# Altium project 总板.PrjPCB
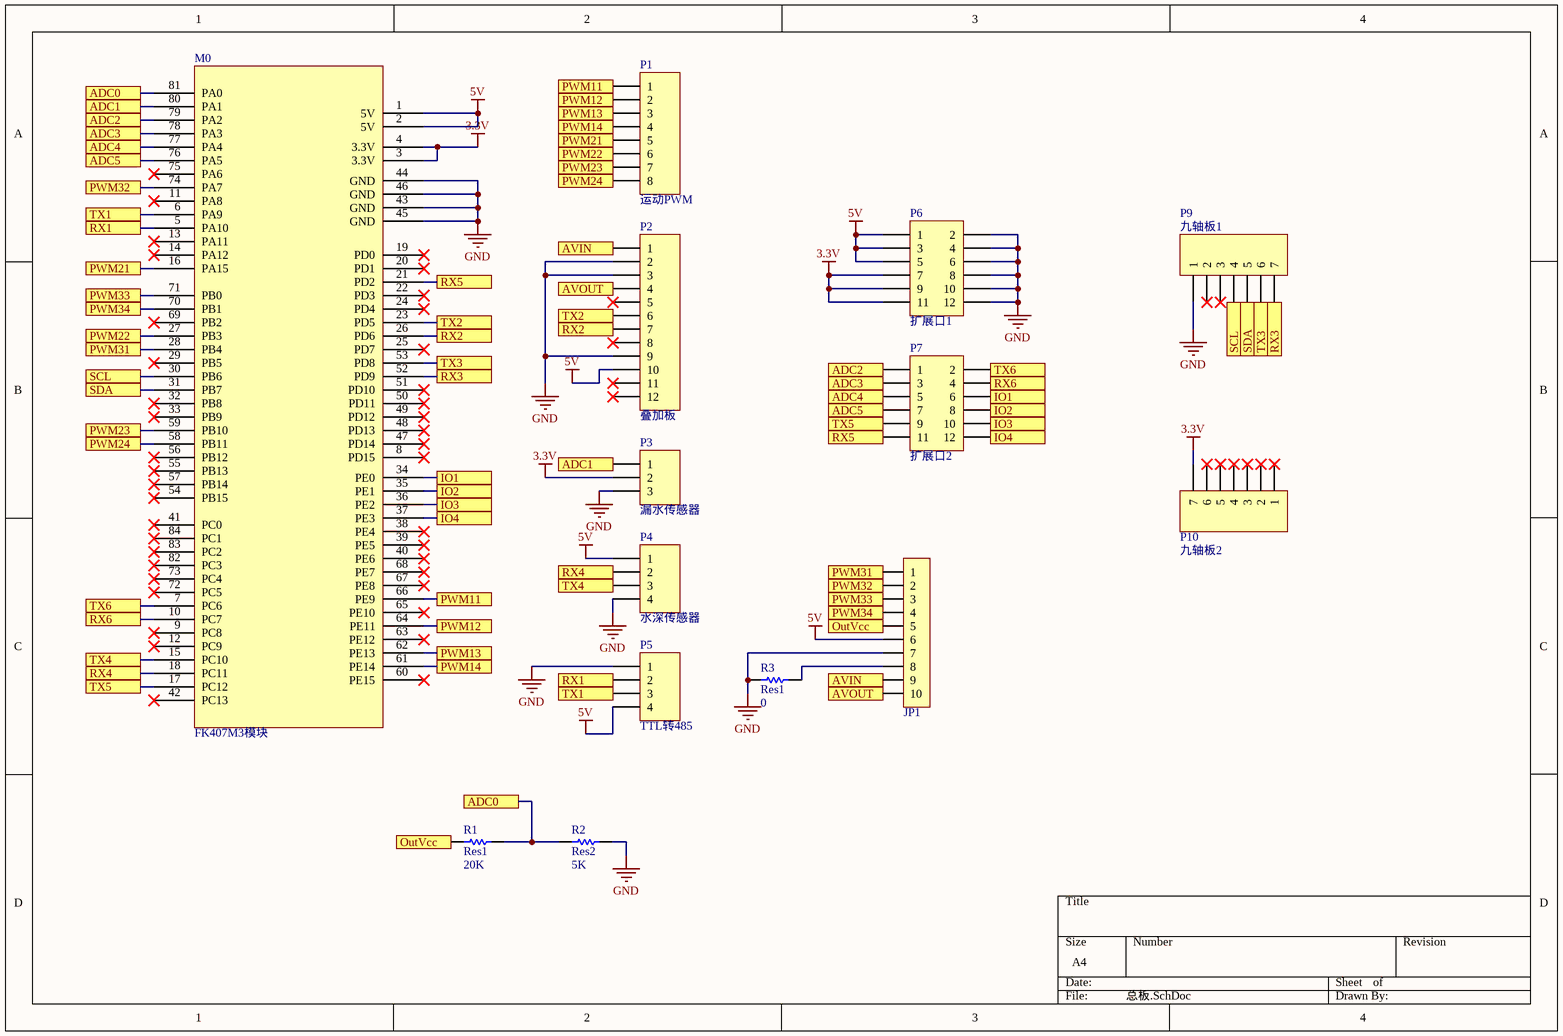
[diagram p0: 总板.SchDoc]
1 sheet, 14 parts. Net scope: flat (ports and power ports of the same name join across sheets).
Board file: 总板.PcbDoc

## Sheet 总板.SchDoc
size A4

### Parts
JP1  HDR-1X10  [KF128-5.08-10P]  (value not drawn)
M0  FK407M3模块  [FK407M3模块]
P1  运动PWM  [HDR1X8]
P2  叠加板  [HDR1X12]
P3  漏水传感器  [HDR1X3]
P4  水深传感器  [HDR1X4]
P5  TTL转485  [HDR1X4]
P6  扩展口1  [HDR2X6]
P7  扩展口2  [HDR2X6]
P9  九轴板1  [HDR1X7]
P10  九轴板2  [HDR1X7]
R1  Res1  value 20K  [AXIAL-0.3]
R2  Res2  value 5K  [AXIAL-0.3]
R3  Res1  value 0  [AXIAL-0.3]

### Ports
ADC0, ADC1, ADC2, ADC3, ADC4, ADC5, AVIN, AVOUT, IO1, IO2, IO3, IO4, OutVcc, PWM11, PWM12, PWM13, PWM14, PWM21, PWM22, PWM23, PWM24, PWM31, PWM32, PWM33, PWM34, RX1, RX2, RX3, RX4, RX5, RX6, SCL, SDA, TX1, TX2, TX3, TX4, TX5, TX6

### Nets
3.3V: M0.3(3.3V) M0.4(3.3V) P3.2 P6.7 P6.9 P6.11 P10.7
5V: JP1.6 M0.1(5V) M0.2(5V) P2.10 P4.1 P5.4 P6.1 P6.3 P6.5
GND: JP1.7 M0.43(GND) M0.44(GND) M0.45(GND) M0.46(GND) P2.2 P2.3 P2.9 P3.3 P4.4 P5.1 P6.2 P6.4 P6.6 P6.8 P6.10 P6.12 P9.1 R2.2 R3.1
NetJP1_1: JP1.1 M0.28(PB4) ; port PWM31
NetJP1_2: JP1.2 M0.74(PA7) ; port PWM32
NetJP1_3: JP1.3 M0.71(PB0) ; port PWM33
NetJP1_4: JP1.4 M0.70(PB1) ; port PWM34
NetJP1_5: JP1.5 R1.1 ; port OutVcc
NetJP1_8: JP1.8 R3.2
NetJP1_9: JP1.9 P2.1 ; port AVIN
NetJP1_10: JP1.10 P2.4 ; port AVOUT
NetM0_5: M0.5(PA10) P5.2 ; port RX1
NetM0_6: M0.6(PA9) P5.3 ; port TX1
NetM0_7: M0.7(PC6) P7.2 ; port TX6
NetM0_10: M0.10(PC7) P7.4 ; port RX6
NetM0_15: M0.15(PC10) P4.3 ; port TX4
NetM0_16: M0.16(PA15) P1.5 ; port PWM21
NetM0_17: M0.17(PC12) P7.9 ; port TX5
NetM0_18: M0.18(PC11) P4.2 ; port RX4
NetM0_21: M0.21(PD2) P7.11 ; port RX5
NetM0_23: M0.23(PD5) P2.6 ; port TX2
NetM0_26: M0.26(PD6) P2.7 ; port RX2
NetM0_27: M0.27(PB3) P1.6 ; port PWM22
NetM0_30: M0.30(PB6) P9.4 ; port SCL
NetM0_31: M0.31(PB7) P9.5 ; port SDA
NetM0_34: M0.34(PE0) P7.6 ; port IO1
NetM0_35: M0.35(PE1) P7.8 ; port IO2
NetM0_36: M0.36(PE2) P7.10 ; port IO3
NetM0_37: M0.37(PE3) P7.12 ; port IO4
NetM0_52: M0.52(PD9) P9.7 ; port RX3
NetM0_53: M0.53(PD8) P9.6 ; port TX3
NetM0_58: M0.58(PB11) P1.8 ; port PWM24
NetM0_59: M0.59(PB10) P1.7 ; port PWM23
NetM0_61: M0.61(PE14) P1.4 ; port PWM14
NetM0_62: M0.62(PE13) P1.3 ; port PWM13
NetM0_64: M0.64(PE11) P1.2 ; port PWM12
NetM0_66: M0.66(PE9) P1.1 ; port PWM11
NetM0_76: M0.76(PA5) P7.7 ; port ADC5
NetM0_77: M0.77(PA4) P7.5 ; port ADC4
NetM0_78: M0.78(PA3) P7.3 ; port ADC3
NetM0_79: M0.79(PA2) P7.1 ; port ADC2
NetM0_80: M0.80(PA1) P3.1 ; port ADC1
NetM0_81: M0.81(PA0) R1.2 R2.1 ; port ADC0

Not connected (* = marked no-connect by the designer): M0 8(PD15)* 9(PC8)* 11(PA8)* 12(PC9)* 13(PA11)* 14(PA12)* 19(PD0)* 20(PD1)* 22(PD3)* 24(PD4)* 25(PD7)* 29(PB5)* 32(PB8)* 33(PB9)* 38(PE4)* 39(PE5)* 40(PE6)* 41(PC0)* 42(PC13)* 47(PD14)* 48(PD13)* 49(PD12)* 50(PD11)* 51(PD10)* 54(PB15)* 55(PB13)* 56(PB12)* 57(PB14)* 60(PE15)* 63(PE12)* 65(PE10)* 67(PE8)* 68(PE7)* 69(PB2)* 72(PC5)* 73(PC4)* 75(PA6)* 82(PC3)* 83(PC2)* 84(PC1)*; P2 5* 8* 11* 12*; P9 2* 3*; P10 1* 2* 3* 4* 5* 6*

### Library data of the parts
JP1 = Header 10: 10P接插件; 版权归属: 源创客; BOM名称: 10P接插件; 学习资源: www.ooocke.com
P1 = Header 8: Header, 8-Pin; LatestRevisionDate: 17-Jul-2002; LatestRevisionNote: Re-released for DXP Platform.; Publisher: Altium Limited
P2 = Header 12: Header, 12-Pin; LatestRevisionDate: 17-Jul-2002; LatestRevisionNote: Re-released for DXP Platform.; Publisher: Altium Limited
P3 = Header 3: Header, 3-Pin; LatestRevisionDate: 17-Jul-2002; LatestRevisionNote: Re-released for DXP Platform.; Publisher: Altium Limited
P4 P5 = Header 4: Header, 4-Pin; LatestRevisionDate: 17-Jul-2002; LatestRevisionNote: Re-released for DXP Platform.; Publisher: Altium Limited
P6 P7 = Header 6X2: Header, 6-Pin, Dual row; LatestRevisionDate: 17-Jul-2002; LatestRevisionNote: Re-released for DXP Platform.; Publisher: Altium Limited
P9 P10 = Header 7: Header, 7-Pin; LatestRevisionDate: 17-Jul-2002; LatestRevisionNote: Re-released for DXP Platform.; Publisher: Altium Limited
R1-R3 = Res1: Resistor; Published: 8-Jun-2000; LatestRevisionDate: 17-Jul-2002; LatestRevisionNote: Re-released for DXP Platform.; PackageReference: AXIAL-0.3; Publisher: Altium Limited; PackageDescription: Axial Device, Thru-Hole; 2 Leads; 0.3 in Pin Spacing